# Altium project Audio_Amplifier.PrjPcb
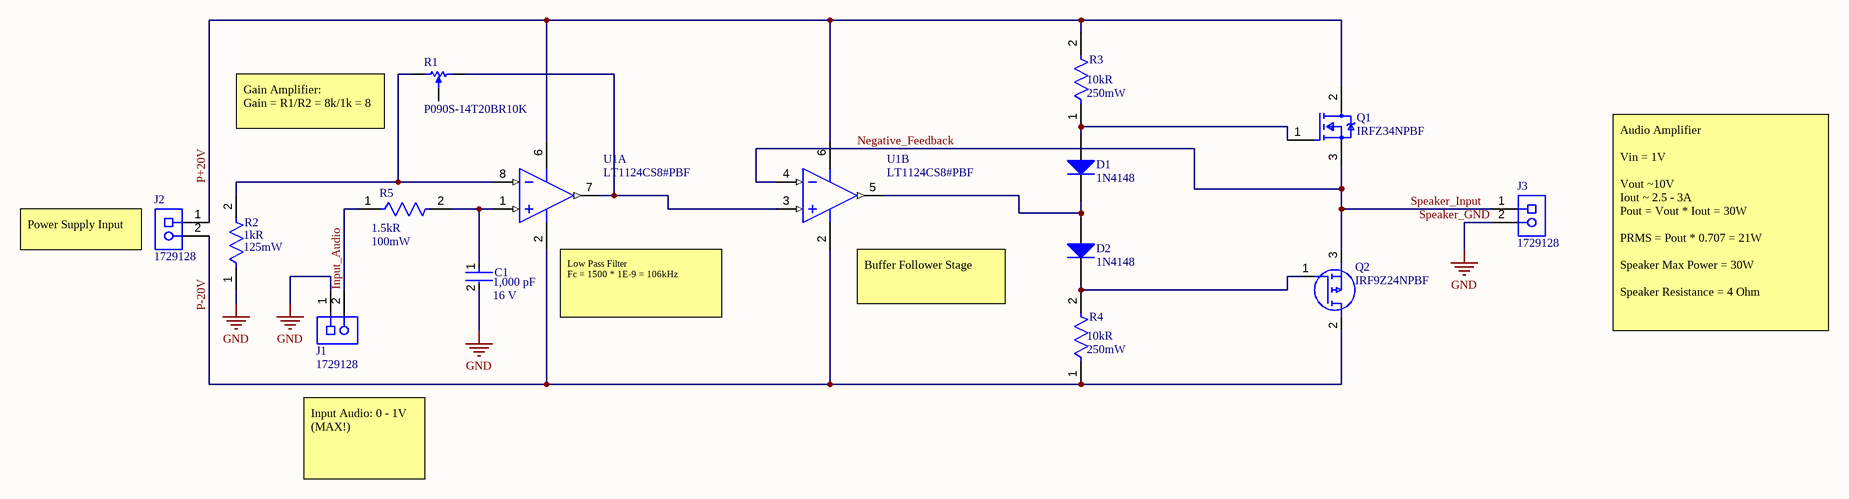
[diagram p0: Audio_Amplifier.SchDoc]
1 sheet, 14 parts. Net scope: global (net labels, ports and power ports of the same name join across sheets).
Board file: Audio_Amplifier.PcbDoc

## Sheet Audio_Amplifier.SchDoc: Audio Amplifier
size 558 x 431 mm; Date: 01/20/2024; Author: Rahim Aziz; DocumentNumber: 1; Revision: 1; SheetNumber: 1; SheetTotal: 1

### Parts
C1  Capacitance: 1,000 pF  Voltage Rating: 16 V  [FP-C1206C-EB-MFG]  (hidden comment: C1206C102K4RACTU)
D1  1N4148  [NXP-SOD27-2_V]
D2  1N4148  [NXP-SOD27-2_V]
J1  1729128  [PHOE-1729128-2_V]
J2  1729128  [PHOE-1729128-2_V]
J3  1729128  [PHOE-1729128-2_V]
Q1  IRFZ34NPBF  [FP-PG-TO220-3-MFG]
Q2  IRF9Z24NPBF  [TO254P469X1042X1967-3P]
R1  P090S-14T20BR10K  [RES-POT-3]
R2  Max Power Dissipation: 125mW  Resistance: 1kR  [FP-RC2012-MFG]  (hidden comment: RC2012F102CS)
R3  Max Power Dissipation: 250mW  Resistance: 10kR  [FP-CRCW1206-e3-IPC_C]  (hidden comment: CRCW120610K0FKEA)
R4  Max Power Dissipation: 250mW  Resistance: 10kR  [FP-CRCW1206-e3-IPC_C]  (hidden comment: CRCW120610K0FKEA)
R5  Resistance: 1.5kR  Power Rating: 100mW  [FP-RC1608-IPC_B]  (hidden comment: RC1608F1501CS)
U1  LT1124CS8#PBF  [LT-S8-8_M]  (parts A,B of 2)

### Nets
Speaker_GND: C1.2 J1.1 J3.2 R2.1  [also labelled GND]
Input_Audio: J1.2 R5.1
Negative_Feedback: J3.1 Q1.3(SOURCE) Q2.3(S) U1.4(-IN_B)  [also labelled Speaker_Input]
P+20V: J2.1 Q1.2(DRAIN) R3.2 U1.6(V+)
P-20V: J2.2 Q2.2(D) R4.1 U1.2(V-)
NetC1_1: C1.1 R5.2 U1.1(+IN_A)
NetD1_1: D1.1(A) Q1.1(GATE) R3.1
NetD1_2: D1.2(K) D2.1(A) U1.5(OUT_B)
NetD2_2: D2.2(K) Q2.1(G) R4.2
NetR1_1: R1.1 R2.2 U1.8(-IN_A)
NetR1_3: R1.3 U1.3(+IN_B) U1.7(OUT_A)

Not connected (* = marked no-connect by the designer): R1 2

### Notes on the sheet
- (near R1) Gain Amplifier:
  Gain = R1/R2 = 8k/1k = 8
- (near J2) Power Supply Input
- (near U1) Low Pass Filter
  Fc = 1500 * 1E-9 = 106kHz
- (near U1) Buffer Follower Stage
- Audio Amplifier
  Vin = 1V
  Vout ~10V
  Iout ~ 2.5 - 3A
  Pout = Vout * Iout = 30W
  PRMS = Pout * 0.707 = 21W
  Speaker Max Power = 30W
  Speaker Resistance = 4 Ohm
- Input Audio: 0 - 1V (MAX!)
- DWG. NO.
- REV.
- SHT.
- REVISION
- DESCRIPTION
- DATE
- APPROVED
- THIS DOCUMENT AND THE DATA DISCLOSED HEREIN OR HEREWITH IS THE PROPERTY OF ALTIUM LIMITED AND MAY BE FREELY DISTRIBUTED IN WHOLE. NO RIGHTS ARE RESERVED OR EXPRESS OR IMPLIED WARANTEE GIVEN.
- ENG:
- DSN:
- APPROVALS
- PROJECT
- DOCUMENT REVISION:
- DESIGN ITEM:
- CHK:
- BOM:
- REFERENCE DOCUMENTS
- PROJECT REVISION:
- TITLE
- FAB DWG:
- PCB DWG:
- ASSY DWG:
- SCALE:
- SIZE
- C
- CAGE CODE
- FILE NAME
- DWG NO.
- SHEET
- OF
- REV

### Library data of the parts
C1 = CMP-1037-02436-2: CAP CER 1000PF 16V 10% X7R 1206; Manufacturer: KEMET; Material: Ceramic; Automotive Grade: Grade 0; Temperature Coefficient: 15%; Value: 1,000 pF; Tolerance: 0.1; Temperature Range High: +150°C; Mouser Description: Cap Ceramic 0.001uF 16V X7R 10% Pad SMD 1206 125C T/R; Manufacturer Part Number: C1206C102K4RACTU; Package: C1206C-EB; Ipc Land Pattern Name: CAPC320160X78; Device Class L3: Ceramic Capacitors; Height: 0.88mm; Octopart: https://octopart.com/c1206c102k4ractu-kemet-19050577; Digikey Description: CAP CER 1000PF 16V 10% X7R 1206; Automotive: Yes; Temperature Range Low: -55°C; Lead Free: Yes; Temperature: -55°C to +150°C; Temperature Characteristic: X7R; ComponentLink2Description: Datasheet; RoHS: TRUE; ComponentLink2URL: https://content.kemet.com/datasheets/KEM_C1007_X8R_ULTRA_150C_SMD.pdf; Category: Cap; Device Class L1: Passive Components; Device Class L2: Capacitors
D1 D2 = CMP-0648-00002-1: High-speed Diode, 100 V, 450 mA, 2-Pin SOD27, RoHS; Manufacturer: NXP Semiconductors; Configuration: Single; IR (VR: 20 V)=25 nA; IFRM: 450 mA; IFSM: 4 A Max.; Trr: 4 ns Max.; Cd: 4 pF Max.; VR: 100 V Max.; VF (IF: 10 mA)=1 V; IF: 200 mA Max.; ComponentLink1Description: Manufacturer URL; RoHS: TRUE; ComponentLink1URL: http://www.nxp.com/; ComponentLink3Description: Package Specification; DatasheetVersion: Aug-04; ComponentLink2Description: Datasheet; PackageVersion: Aug-04; PackageReference: SOD27; ComponentLink3URL: http://www.nxp.com/documents/data_sheet/1N4148_1N4448.pdf; Mounting Technology: Through Hole; ComponentLink2URL: http://www.nxp.com/documents/data_sheet/1N4148_1N4448.pdf; PartNumber: 1N4148; PackageDescription: 2-Pin Hermetically Sealed Glass Package, Axial Leaded, Dia 1.85 mm, Body Length 4.25 mm, Lead Spread 25.4 mm
J1-J3 = CMP-2000-05815-1: PCB Terminal Block, 13.5 A, 400 V, 2-Pin THD, RoHS, Bulk; Manufacturer: Phoenix Contact; Package Version: 03/2015; No. of Rows: 1; Pitch: 5.08mm; No. of Positions: 2; Voltage Rating: 400V; Current Rating: 13500mA; Manufacturer URL: http://www.phoenixcontact.com/; Datasheet URL: https://datasheet.ciiva.com/16046/1729128-16046181.pdf; RoHS: TRUE; Package URL: https://www.phoenixcontact.com/online/portal/pi/pxc/product_detail_page/!ut/p/b1/3VdJjqNKFDxLH8AFycySyWY2ozFsEPOMMQaDOX1XedGL_1Vdm5YXJleknhSKeBkvI6EA8ncAo3AYoDhBQGco6KN7VURTdemj9us_IEKEZo_YHiPAEWEFmDGOHMORkqKYCORBZxgL7ZoaZYcbFFUZ3fqxSY6GOuxydWUuHqz1ynmMFygu583Bob0Ewr6Sd_l-5m-kAueHiB0jpRwZwe58wwtkpxtMYd_LmGcDRU02dRNEyWt6Y2ti5pSyJ_reIkzIulrqApdnbT11V5jnCKbYNCvhEM1MCpPByat_X379-iThf08CI5GfOPqfBeS3BRoBOdD55AKVv0iLwCMq-2BrzXWSGRH7pUGD9uwXQjiph3xL0DKQwdGa0JImiIOmBNOestqgwTHSSs2oOep-78apyXQBvNi8ZLaFjvjWvcaUEBu0MC6Wbe-d6mB0FAebo2lUWinqYaZs5DAYzV0RP9yitUjnGJ0iI9xhZkT42OCQNUJJhkgWINNQLP2JFP6OpMg3JCVg70jqHT0lvKOnhHf0lPuOnnLf0VPuWx6_dxwUIvwk5WMkT0kLL1mh61l2yZVSzG3pYV_bqo-mj6uMKwKwdnnW8Jh5RTOJzMOA5c-eJDaZQw4mTMPH02PvS_ZAqNVjVTo2WyYLkwH_KU1mmmG5kjRhDqPXLwwVHvVOjCM60-fpXvTDfMGW1PVFVS1r4e4yVDk4ZdNbkUHvqPqQSeian4UD39fNKmachqdJ1NJbyk8rXT9mXTvPk3oE5meulKGgiruPJek-4I9hTT6G8ZLOyRSm2RRVbThERQad5OS28hdt4YW4vG0stgYYzsWsK4_7y6DZMjJSCqri1kyiZR5vD7pwIrNR7QwPHTcLTI5qT7eRlpHrdGiupYlqQDJ7zy_CND8fWWBoLRXxk1RVcXiBQwbTD4Xi7KL-FuO94t9xaqweXzH; PartNumber: 1729128; Package Description: 2-Pin Through Hole Device, Body 8.1 x 10.16 mm, Pitch 5.08 mm; Datasheet Version: 12/2013; Mounting Technology: ThroughHole; Orientation: Horizontal; Package Reference: 1729128-2; Packing: Bulk
Q1 = CMP-32901-000547-1: MOSFET N-CH 55V 29A TO220AB; Rise Time: 49ns; Turn-On Delay Time: 7ns; Input Capacitance: 700pF; Drain to Source Resistance: 40mR; Turn-Off Delay Time: 31ns; Power Dissipation: 68W; Gate to Source Voltage (Vgs): 20V; Element Configuration: Single; Threshold Voltage: 4V; Packaging: Rail/Tube; Number of Pins: 3; Height: 0.6inch; Case/Package: TO-220; Min Operating Temperature: -55°C; Max Operating Temperature: 175°C; RoHS Compliant: Yes; Width: 0.185inch; Lead Free: Lead Free; Contact Plating: Tin; Drain to Source Breakdown Voltage: 55V; Length: 0.414inch; Mount: Through Hole; Max Power Dissipation: 68W; Halogen Free: Not Halogen Free; Max Dual Supply Voltage: 55V; Rds On Max: 40mR; Continuous Drain Current (ID): 29A; Drain to Source Voltage (Vdss): 55V; REACH SVHC: No SVHC
Q2 = CMP-041-000000-2: Infineon IRF9Z24NPBF P-channel MOSFET Transistor, 12 A, 55 V, 3-Pin TO-220AB; Geometry.Height: 4.69mm; Mouser Price/Stock: https://www.mouser.co.uk/ProductDetail/Infineon-IR/IRF9Z24NPBF?qs=9%252BKlkBgLFf36xC9PMFW8Lg%3D%3D; Manufacturer_Part_Number: IRF9Z24NPBF; Datasheet Link: https://www.infineon.com/dgdl/irf9z24npbf.pdf?fileId=5546d462533600a40153561218961ddb; Source: IRF9Z24NPBF.SchLib; Arrow Price/Stock: https://www.arrow.com/en/products/irf9z24npbf/infineon-technologies-ag?region=nac; Arrow Part Number: IRF9Z24NPBF; Manufacturer_Name: Infineon; Design Item ID: IRF9Z24NPBF; Mouser Part Number: 942-IRF9Z24NPBF
R1 = CMP-2000-06871-1: 9 mm Rotary Potentiometer, Insulated Shaft, Conductive Plastic Element, 10 KOhm, -20 to 70 degC, 3-Pin THD, RoHS, Tray; Manufacturer: BI Technologies; Actuator Type: Knurled; Power Rating: 0.03W; Tolerance: ±20%; Actuator Diameter: 0.236"(6.00mm); Other Names: 987-1277P090S14T20BR10K; Actuator Length: 0.787"(20.00mm); Number of Gangs: 1; Online Catalog: P090Series; Power (Watts): 0.03W,1/32W; Built in Switch: Detent; Resistance (Ohms): 10k; Adjustment Type: TopAdjustment; Rotation: 280°; Package Description: POT, 3-Leads, Body 9.8 x 12.5 mm, Pitch 2.5 mm; Bushing Thread: -; Package Reference: POT-3; Datasheet URL: http://www.bitechnologies.com/pdfs/p090.pdf; Packaging: Tray; Manufacturer URL: http://www.bi-technologies.net/; Package URL: http://www.bitechnologies.com/pdfs/p090.pdf; Mounting Technology: ThroughHole; Datasheet Version: 07/2008; Taper: Linear; Resistive Material: ConductivePlastic; Mounting Type: ThroughHole; Temperature Coefficient: -; Standard Package: 1; Category: Potentiometers,VariableResistors; Family: RotaryPotentiometers,Rheostats; Termination Style: PCBPins,BoardLocks; Series: P090; Number of Turns: 1
R2 = CMP-13261-003265-1: Res Thick Film 0805 1kΩ 1% 0.125W ±100ppm/°C Molded SMD T/R; Voltage Rating (DC): 150V; Height: 0.024inch; Military Standard: Not; Min Operating Temperature: -55°C; Composition: Thick Film; Case Code (Metric): 2012; Lead Free: Lead Free; Contact Plating: Tin; Max Operating Temperature: 155°C; Case/Package: 0805; Case Code (Imperial): 0805; Radiation Hardening: No; Width: 0.049inch; Number of Terminations: 2; Tolerance: 1%; Features: Moisture Resistant; Packaging: Tape and Reel; Temperature Coefficient: 100ppm/°C; Length: 0.079inch; Depth: 1.25mm
R3 R4 = CMP-2003-04807-2: RES Thick Film, 10kΩ, 1%, 0.25W, 100ppm/°C, 1206; Working Voltage: 200V; Tolerance: 1%; Width: 0.063inch; Height: 0.55mm; Number of Pins: 2; Voltage Rating: 200V; Temperature Coefficient: 100ppm/°C; Military Standard: Not; Features: Automotive AEC-Q200; Depth: 1.6mm; Radiation Hardening: No; Termination: SMD/SMT; Case Code (Imperial): 1206; Weight: 0.000353oz; Length: 3.2mm; Package Quantity: 10; Voltage Rating (DC): 200V; Case/Package: 1206; Min Operating Temperature: -55°C; Number of Terminations: 2; Composition: Thick Film; Contact Plating: Tin; Power Rating: 250mW; Packaging: Tape and Reel; Max Operating Temperature: 155°C; Lead Free: Lead Free; Case Code (Metric): 3216
R5 = CMP-13261-004935-1: Res Thick Film 0603 1.5kΩ 1% 0.1W ±100ppm/°C Molded SMD T/R; Voltage Rating (DC): 50V; Contact Plating: Tin; Depth: 0.8mm; Width: 800um; Tolerance: 1%; Lead Free: Lead Free; Composition: Thick Film; Military Standard: Not; Temperature Coefficient: 100ppm/°C; Radiation Hardening: No; Length: 1.6mm; Case/Package: 0603; Max Operating Temperature: 155°C; Packaging: Tape and Reel; Min Operating Temperature: -55°C
U1 = CMP-0359-03018-2: Dual Channel, Rotated Pinout, Low Noise Precision Operational Amplifier, Low 1/f Corner, 12.5 MHz Typical GBW, 4.5 V/us Typical SR, 8 to 44 V, 8-Pin SOIC (S8-8), Commercial, Pb-Free; Manufacturer: Linear Technology; Linear Technology Part Number: LT1124-1; Vs Min (V): 8; Vos (mV) Typical: 0.02; GBW (MHz) Typical: 12.5; Channels (#): 2; SR (V/us) Typical: 4.5; Is (mA) Typical: 2.3; Vs Max (V): 44; DatasheetVersion: Rev. E; RoHS: Pb-Free; RevisionNote: URLs updated; Mounting Technology: Surface Mount; ComponentLink1URL: http://www.linear.com/; Type: VFB; ComponentLink2URL: http://cds.linear.com/docs/en/datasheet/11245fe.pdf; PackageVersion: Rev G; ComponentLink1Description: Manufacturer URL; PackageDescription: 8-Pin Plastic Small Outline, Body 4.9 x 3.9 mm, Pitch 1.27 mm; PackageReference: LT-S8-8; PartNumber: LT1124CS8#PBF; ComponentLink2Description: Datasheet; ComponentLink3URL: http://cds.linear.com/docs/en/packaging/05081610_G_SO8.pdf; ComponentLink3Description: Package Specification